# EAGLE design waldo-badge-2015-r1 (EAGLE 5.12)
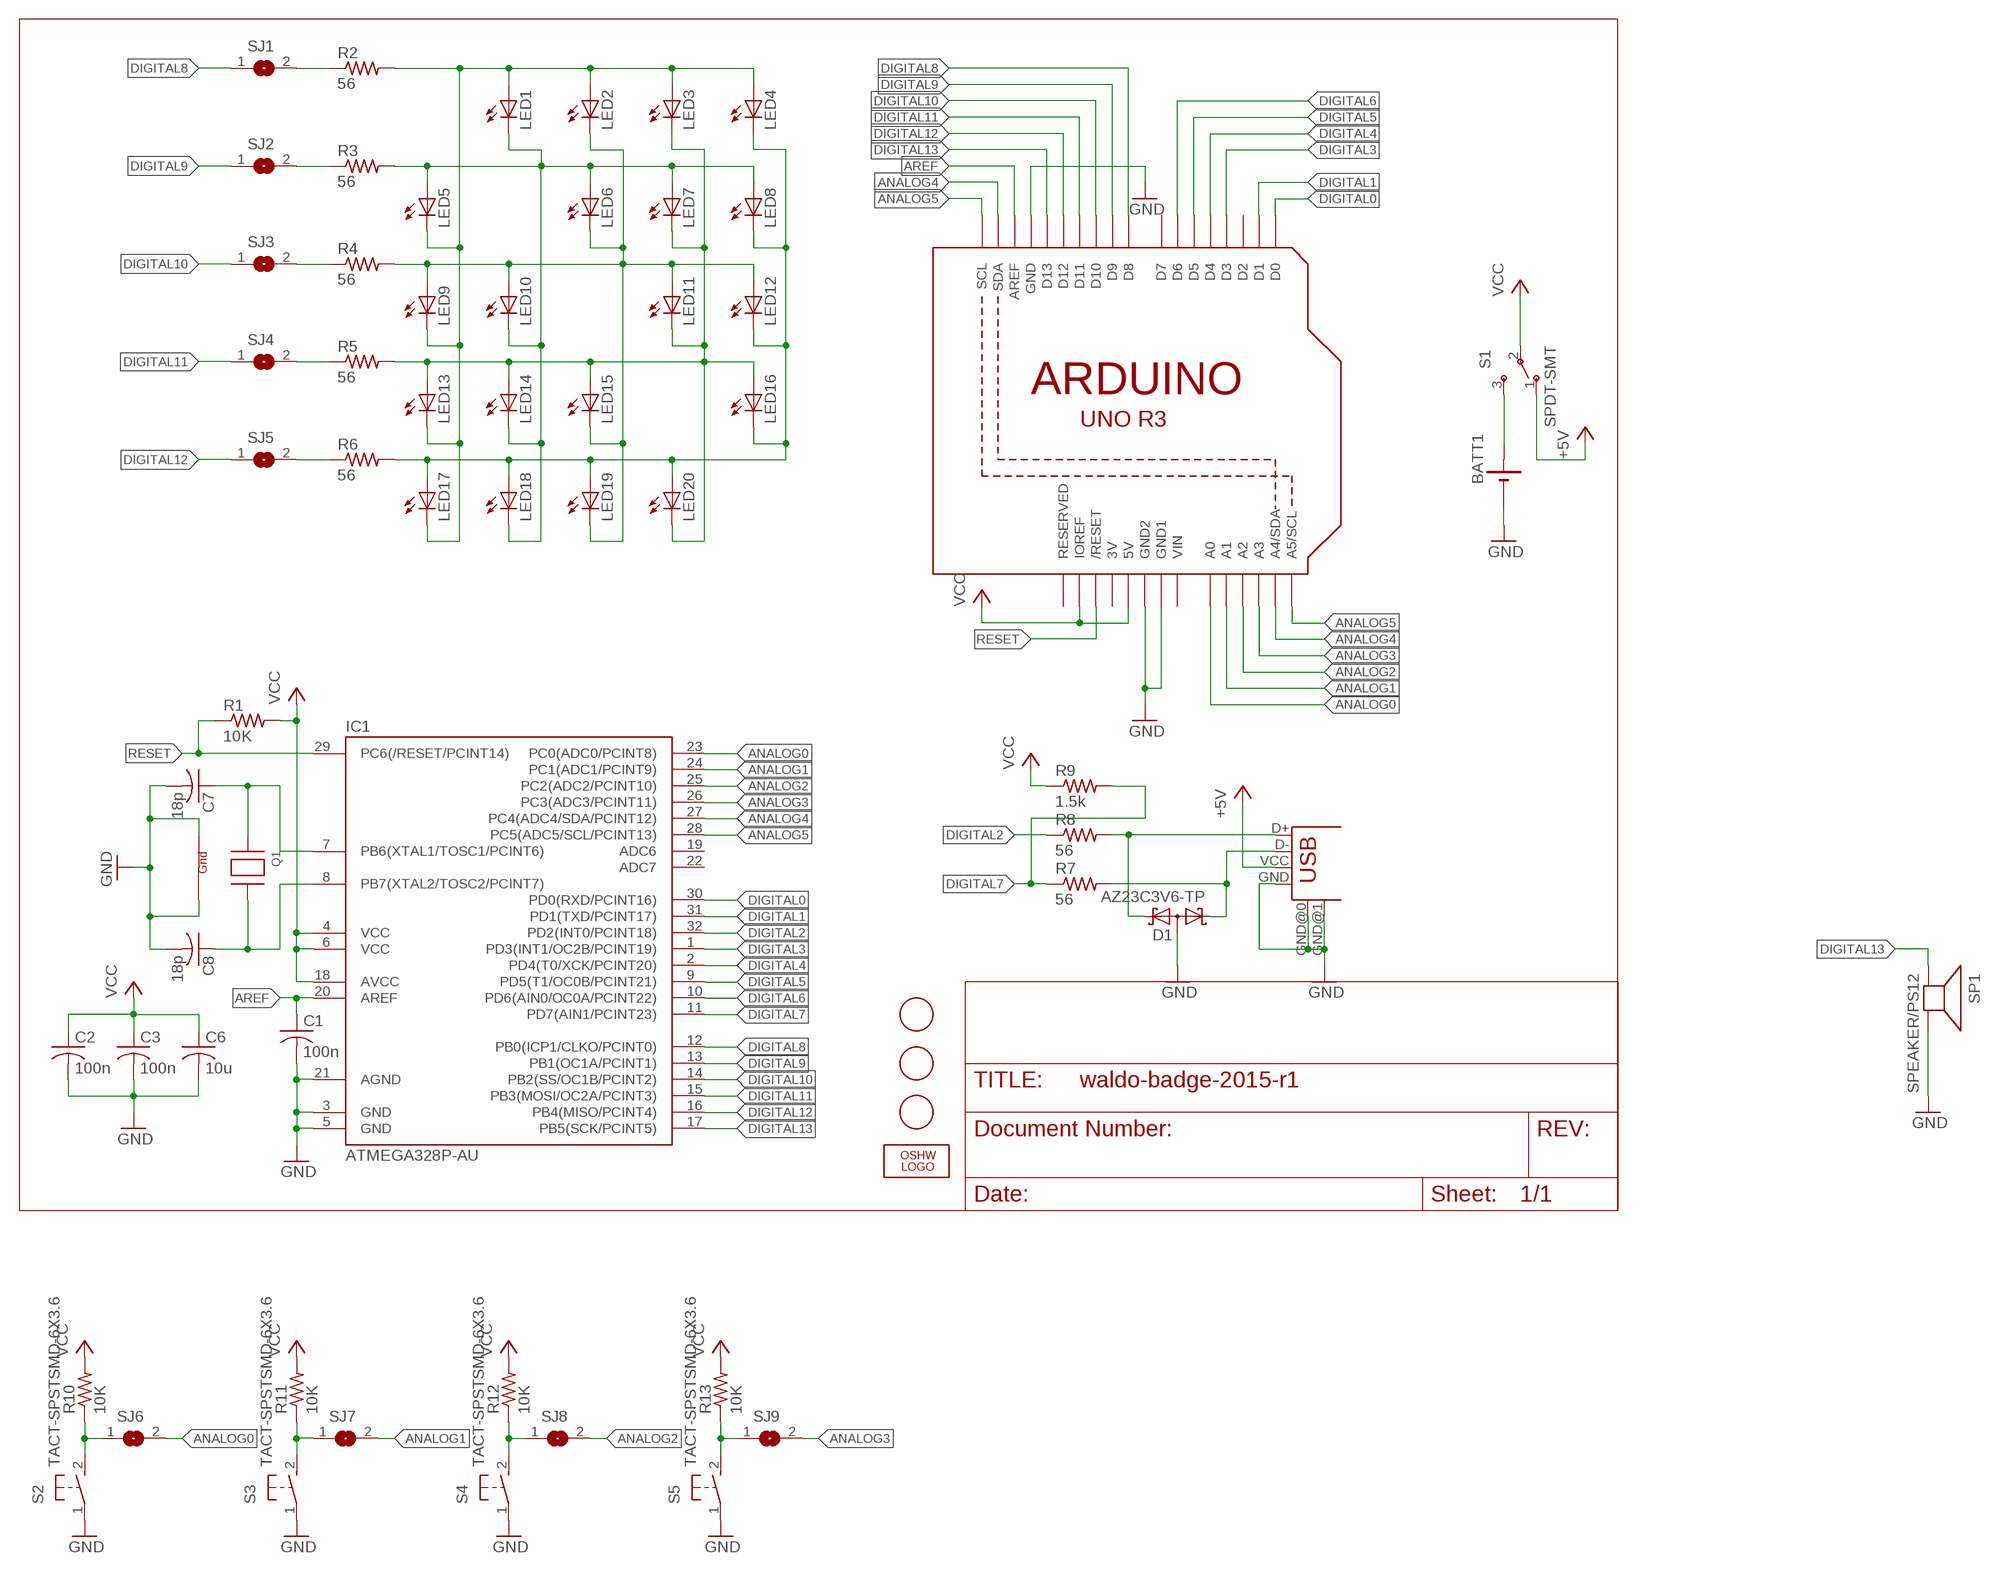
[diagram p0: schematic, sheet 1]

## Parts
BATT1  2032SMD  [2032SMD]
C1  100n  C-USC0603  [C0603]
C2  100n  C-USC0603  [C0603]
C3  100n  C-USC0603  [C0603]
C6  10u  C-USC0805  [C0805]
C7  18p  C-USC0603  [C0603]
C8  18p  C-USC0603  [C0603]
D1  AZ23C3V6-TP  BAS40-06  [SOT23]
IC1  ATMEGA328P-AU  MEGA48/88/168-AU  [TQFP32-08]
LED1  LEDCHIP-LED0603  [CHIP-LED0603]
LED2  LEDCHIP-LED0603  [CHIP-LED0603]
LED3  LEDCHIP-LED0603  [CHIP-LED0603]
LED4  LEDCHIP-LED0603  [CHIP-LED0603]
LED5  LEDCHIP-LED0603  [CHIP-LED0603]
LED6  LEDCHIP-LED0603  [CHIP-LED0603]
LED7  LEDCHIP-LED0603  [CHIP-LED0603]
LED8  LEDCHIP-LED0603  [CHIP-LED0603]
LED9  LEDCHIP-LED0603  [CHIP-LED0603]
LED10  LEDCHIP-LED0603  [CHIP-LED0603]
LED11  LEDCHIP-LED0603  [CHIP-LED0603]
LED12  LEDCHIP-LED0603  [CHIP-LED0603]
LED13  LEDCHIP-LED0603  [CHIP-LED0603]
LED14  LEDCHIP-LED0603  [CHIP-LED0603]
LED15  LEDCHIP-LED0603  [CHIP-LED0603]
LED16  LEDCHIP-LED0603  [CHIP-LED0603]
LED17  LEDCHIP-LED0603  [CHIP-LED0603]
LED18  LEDCHIP-LED0603  [CHIP-LED0603]
LED19  LEDCHIP-LED0603  [CHIP-LED0603]
LED20  LEDCHIP-LED0603  [CHIP-LED0603]
LOGO1  OSHW_LOGO_FILLX0150-NT  [OSHW_FILLX150_NOTEXT]
Q1  XTAL-4-3225  [NX3225]
R1  10K  R-US_R0603  [R0603]
R2  56  R-US_R0603  [R0603]
R3  56  R-US_R0603  [R0603]
R4  56  R-US_R0603  [R0603]
R5  56  R-US_R0603  [R0603]
R6  56  R-US_R0603  [R0603]
R7  56  R-US_R0603  [R0603]
R8  56  R-US_R0603  [R0603]
R9  1.5k  R-US_R0603  [R0603]
R10  10K  R-US_R0603  [R0603]
R11  10K  R-US_R0603  [R0603]
R12  10K  R-US_R0603  [R0603]
R13  10K  R-US_R0603  [R0603]
S1  SPDT-SMT  [SPDT-SMT]
S2  TACT-SPSTSMD-6X3.6  [6X3.6-SPST]
S3  TACT-SPSTSMD-6X3.6  [6X3.6-SPST]
S4  TACT-SPSTSMD-6X3.6  [6X3.6-SPST]
S5  TACT-SPSTSMD-6X3.6  [6X3.6-SPST]
SJ1  SJ  [SJ]
SJ2  SJ  [SJ]
SJ3  SJ  [SJ]
SJ4  SJ  [SJ]
SJ5  SJ  [SJ]
SJ6  SJ  [SJ]
SJ7  SJ  [SJ]
SJ8  SJ  [SJ]
SJ9  SJ  [SJ]
SP1  SPEAKER/PS12  [PS12]
U1  ARDUINOR3-NOISP  [ARDUINOR3-NOISP]
U$3  FIDUCIAL  [FIDUCIAL_1MM]
U$5  FIDUCIAL  [FIDUCIAL_1MM]
U$6  FIDUCIAL  [FIDUCIAL_1MM]
USB1  USB-U  [USB-MICROB-ALI]

## Nets
+5V: S1.1(O) USB1.VCC(VBUS)
ANALOG0: IC1.23(PC0(ADC0/PCINT8)) SJ6.2 U1.A0
ANALOG1: IC1.24(PC1(ADC1/PCINT9)) SJ7.2 U1.A1
ANALOG2: IC1.25(PC2(ADC2/PCINT10)) SJ8.2 U1.A2
ANALOG3: IC1.26(PC3(ADC3/PCINT11)) SJ9.2 U1.A3
ANALOG4: IC1.27(PC4(ADC4/SDA/PCINT12)) U1.A4(A4/SDA) U1.SDA
ANALOG5: IC1.28(PC5(ADC5/SCL/PCINT13)) U1.A5(A5/SCL) U1.SCL
AREF: C1.1 IC1.20(AREF) U1.AREF
CHARLIEPLEX1: LED1.A LED2.A LED3.A LED4.A LED5.C LED9.C LED13.C LED17.C R2.2
CHARLIEPLEX2: LED1.C LED5.A LED6.A LED7.A LED8.A LED10.C LED14.C LED18.C R3.2
CHARLIEPLEX3: LED2.C LED6.C LED9.A LED10.A LED11.A LED12.A LED15.C LED19.C R4.2
CHARLIEPLEX4: LED3.C LED7.C LED11.C LED13.A LED14.A LED15.A LED16.A LED20.C R5.2
CHARLIEPLEX5: LED4.C LED8.C LED12.C LED16.C LED17.A LED18.A LED19.A LED20.A R6.2
DIGITAL0: IC1.30(PD0(RXD/PCINT16)) U1.D0
DIGITAL1: IC1.31(PD1(TXD/PCINT17)) U1.D1
DIGITAL2: IC1.32(PD2(INT0/PCINT18)) R8.1
DIGITAL3: IC1.1(PD3(INT1/OC2B/PCINT19)) U1.D3
DIGITAL4: IC1.2(PD4(T0/XCK/PCINT20)) U1.D4
DIGITAL5: IC1.9(PD5(T1/OC0B/PCINT21)) U1.D5
DIGITAL6: IC1.10(PD6(AIN0/OC0A/PCINT22)) U1.D6
DIGITAL7: IC1.11(PD7(AIN1/PCINT23)) R7.1 R9.2
DIGITAL8: IC1.12(PB0(ICP1/CLKO/PCINT0)) SJ1.1 U1.D8
DIGITAL9: IC1.13(PB1(OC1A/PCINT1)) SJ2.1 U1.D9
DIGITAL10: IC1.14(PB2(SS/OC1B/PCINT2)) SJ3.1 U1.D10
DIGITAL11: IC1.15(PB3(MOSI/OC2A/PCINT3)) SJ4.1 U1.D11
DIGITAL12: IC1.16(PB4(MISO/PCINT4)) SJ5.1 U1.D12
DIGITAL13: IC1.17(PB5(SCK/PCINT5)) SP1.P$1(+) U1.D13
GND: BATT1.- C1.2 C2.2 C3.2 C6.2 C7.2 C8.2 D1.3(AA) IC1.3(GND) IC1.5(GND) IC1.21(AGND) Q1.2(G1) Q1.4(G2) S2.1(P) S3.1(P) S4.1(P) S5.1(P) SP1.P$2(-) U1.GND U1.GND1 U1.GND2 USB1.GND USB1.GND@0(GND) USB1.GND@1(GND)
N$1: R2.1 SJ1.2
N$3: R3.1 SJ2.2
N$5: R4.1 SJ3.2
N$6: BATT1.+ S1.3(S)
N$7: R5.1 SJ4.2
N$8: D1.2(K2) R8.2 USB1.D+
N$9: R6.1 SJ5.2
N$10: C7.1 IC1.7(PB6(XTAL1/TOSC1/PCINT6)) Q1.1(X1)
N$11: D1.1(K1) R7.2 USB1.D-
N$16: R10.1 S2.2(S) SJ6.1
N$17: R11.1 S3.2(S) SJ7.1
N$18: C8.1 IC1.8(PB7(XTAL2/TOSC2/PCINT7)) Q1.3(X2)
N$19: R12.1 S4.2(S) SJ8.1
N$20: R13.1 S5.2(S) SJ9.1
RESET: IC1.29(PC6(/RESET/PCINT14)) R1.1 U1.RESET(/RESET)
VCC: C2.1 C3.1 C6.1 IC1.4(VCC) IC1.6(VCC) IC1.18(AVCC) R1.2 R9.1 R10.2 R11.2 R12.2 R13.2 S1.2(P) U1.5V U1.IOREF
Unconnected: IC1.19(ADC6) IC1.22(ADC7) U1.D2 U1.D7 U1.RESERVED

## Power pins joined to a net without a drawn wire
3V: U1.3V
VIN: U1.VIN

## Library data of the parts
BATT1 = rbg-4ucon-battery:2032SMD
C1-C3 C6-C8 = rcl:C-US: CAPACITOR, American symbol
D1 = diode:BAS40-06: Silicon Schottky Diodes General-purpose diode for high-speed switching
IC1 = avr-4:MEGA48/88/168
LED1-LED20 = led:LED: LED OSRAM: - CHIPLED LG R971, LG N971, LY N971, LG Q971, LY Q971, LO R971, LY R971 LH N974, LH R974 LS Q976, LO Q976, LY Q976 LO Q996 - Hyper CHIPLED LW Q18S LB Q993, LB Q99A, LB R99A - SideLED LS A670, LO A670, LY A670, LG A670, LP A670 LB A673, LV A673, LT A673, LW A673 LH A674 LY A675 LS A676, LA A676, LO A676, LY A676, LW A676 LS A679, LY A679, LG A679 - Hyper Micro SIDELED® LS Y876, LA Y876, LO Y876, LY Y876 LT Y87S - SmartLED LW L88C, LW L88S LB L89C, LB L89S, LG L890 LS L89K, LO L89K, LY L89K LS L896, LA L896, LO L896, LY L896 - TOPLED LS T670, LO T670, LY T670, LG T670, LP T670 LSG T670, LSP T670, LSY T670, LOP T670, LYG T670 LG T671, LOG T671, LSG T671 LB T673, LV T673, LT T673, LW T673 LH T674 LS T676, LA T676, LO T676, LY T676, LB T676, LH T676, LSB T676, LW T676 LB T67C, LV T67C, LT T67C, LS T67K, LO T67K, LY T67K, LW E67C LS E67B, LA E67B, LO E67B, LY E67B, LB E67C, LV E67C, LT E67C LW T67C LS T679, LY T679, LG T679 LS T770, LO T770, LY T770, LG T770, LP T770 LB T773, LV T773, LT T773, LW T773 LH T774 LS E675, LA E675, LY E675, LS T675 LS T776, LA T776, LO T776, LY T776, LB T776 LHGB T686 LT T68C, LB T68C - Hyper Mini TOPLED® LB M676 - Mini TOPLED Santana® LG M470 LS M47K, LO M47K, LY M47K Source: http://www.osram.convergy.de LUXEON: - LUMILED® LXK2-PW12-R00, LXK2-PW12-S00, LXK2-PW14-U00, LXK2-PW14-V00 LXK2-PM12-R00, LXK2-PM12-S00, LXK2-PM14-U00 LXK2-PE12-Q00, LXK2-PE12-R00, LXK2-PE12-S00, LXK2-PE14-T00, LXK2-PE14-U00 LXK2-PB12-K00, LXK2-PB12-L00, LXK2-PB12-M00, LXK2-PB14-N00, LXK2-PB14-P00, LXK2-PB14-Q00 LXK2-PR12-L00, LXK2-PR12-M00, LXK2-PR14-Q00, LXK2-PR14-R00 LXK2-PD12-Q00, LXK2-PD12-R00, LXK2-PD12-S00 LXK2-PH12-R00, LXK2-PH12-S00 LXK2-PL12-P00, LXK2-PL12-Q00, LXK2-PL12-R00 Source: www.luxeon.com KINGBRIGHT: KA-3528ASYC Source: www.kingbright.com
LOGO1 = ohw-logo:OSHW_LOGO_FILL
Q1 = adafruit:XTAL-4: Classic 4-pin 3.2 x 2.5mm crystal
R1-R13 = rcl:R-US_: RESISTOR, American symbol
S1 = smt-spdt-aliexpress:SPDT-SMT
S2-S5 = rbg-generic-tact-switch:TACT-SPST
SJ1-SJ9 = jumper:SJ: SMD solder JUMPER
SP1 = adafruit:SPEAKER: SPEAKER Source: Buerklin Added PS12 (for part # PS1240 piezo) http://www.ladyada.net/library/pcb/eaglelibrary.html
U1 = rbg-arduino-shield:ARDUINOR3-NOISP
U$3 U$5 U$6 = adafruit:FIDUCIAL: For use by pick and place machines to calibrate the vision/machine, 1mm By microbuilder.eu
USB1 = con-usb-2:USB: USB Connectors

## Board
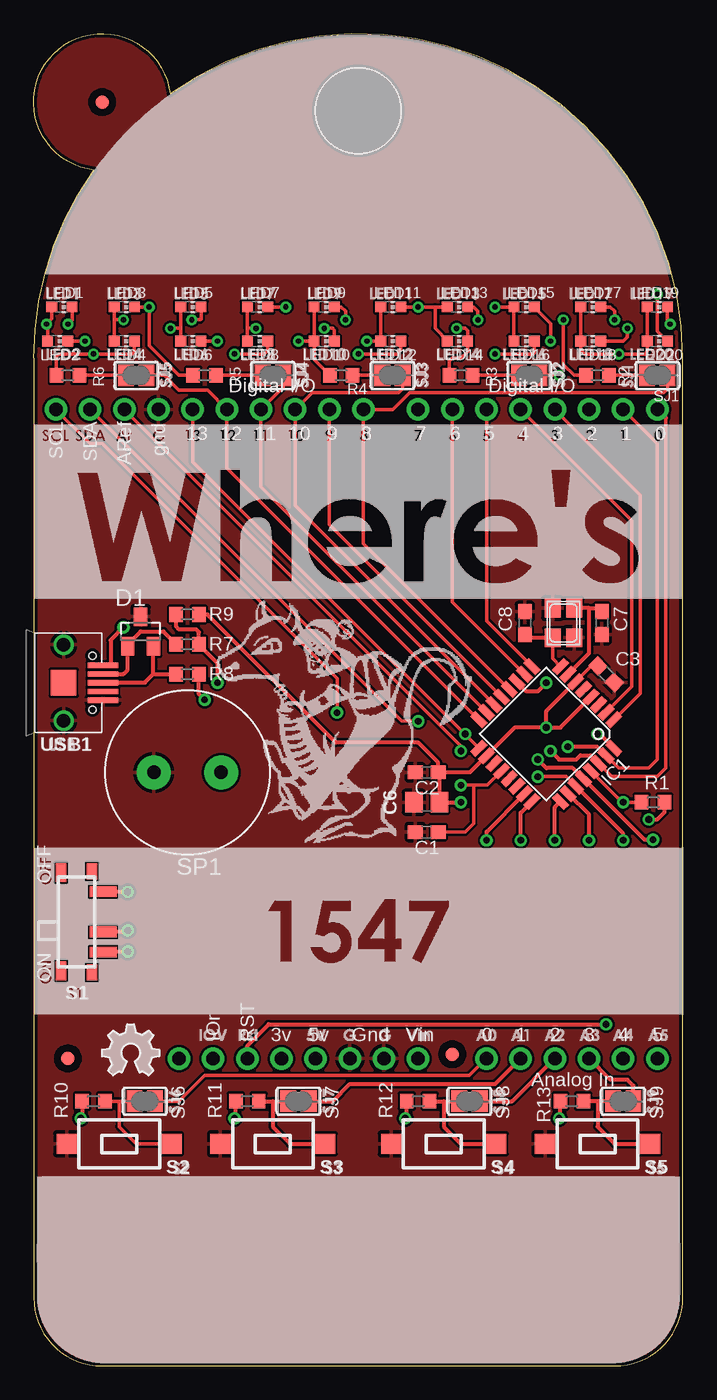
[diagram p1: board, top side]
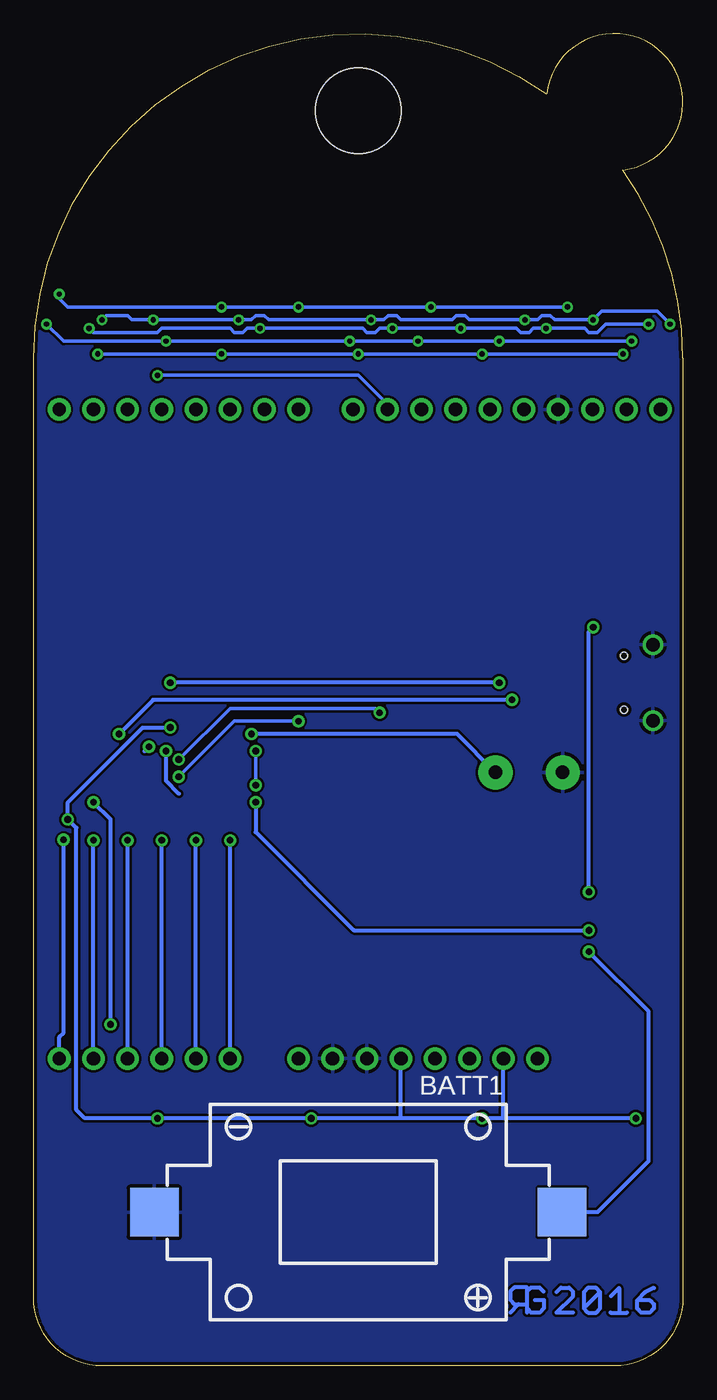
[diagram p2: board, bottom side, seen from below]

Size 48.27 x 99.07 mm. Coordinates in mm from the lower left corner, seen from the top.
Outline: 4.48,88.92 arc35 0.01,74.93 0.01,5.08 arc90 5.09,0 43.19,0 arc90 48.27,5.08 48.27,74.93 arc125 10.15,94.59
Outline: 4.48,88.92 arc-256 10.14,94.59
Copper layers (1*16): Top 0.035mm / dielectric 1.5mm / Bottom 0.035mm
Design rules "default *": minimum track width 8mil, minimum drill 0.4mm, track to track 7mil, track to pad 7mil, pad to pad 7mil, via to via 7mil, smd to smd 7mil, copper to edge 10mil, drill to drill 8mil, minimum pad ring 10mil, minimum via ring 8mil, stop-mask expansion 4mil, vias tented up to drill 20mil, thermal gap 10mil
Holes 6.35 mm at 24.14,93.34

### Footprints (pad centres in the part's own frame; a part is rotated, then mirrored left to right if it is on the bottom)
2032SMD = smd 3.6 x 3.6: + -15.15,0; - 15.15,0
C0603 = smd 1.1 x 1: 1 -0.85,0; 2 0.85,0
C0805 = smd 1.3 x 1.5: 1 -0.95,0; 2 0.95,0
SOT23 = smd 1 x 1.4: 1 -0.95,-1.1; 2 0.95,-1.1; 3 0,1.1
TQFP32-08 = smd 1.27 x 0.559: 1 -4.293,2.8; 2 -4.293,2; 3 -4.293,1.2; 4 -4.293,0.4; 5 -4.293,-0.4; 6 -4.293,-1.2; 7 -4.293,-2; 8 -4.293,-2.8; 17 4.293,-2.8; 18 4.293,-2; 19 4.293,-1.2; 20 4.293,-0.4; 21 4.293,0.4; 22 4.293,1.2; 23 4.293,2; 24 4.293,2.8 | smd 0.559 x 1.27: 9 -2.8,-4.293; 10 -2,-4.293; 11 -1.2,-4.293; 12 -0.4,-4.293; 13 0.4,-4.293; 14 1.2,-4.293; 15 2,-4.293; 16 2.8,-4.293; 25 2.8,4.293; 26 2,4.293; 27 1.2,4.293; 28 0.4,4.293; 29 -0.4,4.293; 30 -1.2,4.293; 31 -2,4.293; 32 -2.8,4.293
CHIP-LED0603 = smd 0.8 x 0.8: A 0,-0.75; C 0,0.75
NX3225 = smd 1.4 x 1.2: 1 -1.1,0.8; 2 1.1,0.8; 3 1.1,-0.8; 4 -1.1,-0.8
R0603 = smd 1 x 1.1: 1 -0.85,0; 2 0.85,0
SPDT-SMT = smd 2 x 0.8: 1 -2,-2.25; 2 -2,0.75; 3 -2,2.25 | smd 0.8 x 1.2: A -1.15,3.75; D -1.15,-3.75 | smd 0.8 x 1.4: B 1.15,3.65; C 1.15,-3.65
6X3.6-SPST = smd 1.5 x 1.5: 1 -3.9,0; 2 3.9,0
SJ = smd 1.168 x 1.6: 1 -0.762,0; 2 0.762,0
PS12 = drill 1 pad 2.54 round: P$1 -2.5,0; P$2 2.5,0
ARDUINOR3-NOISP = drill 1 pad 1.676 round: 3V 17.78,2.54; 5V 20.32,2.54; A0 33.02,2.54; A1 35.56,2.54; A2 38.1,2.54; A3 40.64,2.54; A4 43.18,2.54; A5 45.72,2.54; AREF 6.096,50.8; D0 45.72,50.8; D1 43.18,50.8; D2 40.64,50.8; D3 38.1,50.8; D4 35.56,50.8; D5 33.02,50.8; D6 30.48,50.8; D7 27.94,50.8; D8 23.876,50.8; D9 21.336,50.8; D10 18.796,50.8; D11 16.256,50.8; D12 13.716,50.8; D13 11.176,50.8; GND 8.636,50.8; GND1 25.4,2.54; GND2 22.86,2.54; IOREF 12.7,2.54; RESERVED 10.16,2.54; RESET 15.24,2.54; SCL 1.016,50.8; SDA 3.556,50.8; VIN 27.94,2.54
FIDUCIAL_1MM = smd 1 x 1: 1 0,0
USB-MICROB-ALI = smd 0.4 x 2.25: D+ 0,2.925; D- -0.65,2.925; GND 1.3,2.925; ID 0.65,2.925; VCC -1.3,2.925 | drill 1 round: GND@0 -2.825,0; GND@1 2.825,0 | smd 1.9 x 1.9: GND@2 0,0 | hole 0.55: -2,2.15; 2,2.15

### Placement (x,y rotation side)
BATT1  24.14,11.43 180 bottom
C1  29.22,39.69 180 top
C2  29.22,44.13 180 top
C3  42.55,51.44 315 top
C6  29.22,41.91 180 top
C7  42.24,55.24 270 top
C8  36.52,55.24 90 top
D1  7.95,54.61 0 top
IC1  38.11,46.99 225 top
LED1  2.1,78.74 270 top
LED2  1.79,76.2 270 top
LED3  6.74,78.74 270 top
LED4  6.74,76.2 270 top
LED5  11.69,78.74 270 top
LED6  11.69,76.2 270 top
LED7  16.65,78.74 270 top
LED8  16.65,76.2 270 top
LED9  21.6,78.74 270 top
LED10  21.6,76.2 270 top
LED11  26.55,78.74 270 top
LED12  26.55,76.2 270 top
LED13  31.51,78.74 270 top
LED14  31.51,76.2 270 top
LED15  36.46,78.74 270 top
LED16  36.46,76.2 270 top
LED17  41.41,78.74 270 top
LED18  41.41,76.2 270 top
LED19  46.36,78.74 270 top
LED20  46.36,76.2 270 top
LOGO1  5.09,21.59 0 top
Q1  39.38,55.24 270 top
R1  46.05,41.91 0 top
R2  41.92,73.66 180 top
R3  31.76,73.66 180 top
R4  22.87,73.66 180 top
R5  12.71,73.66 180 top
R6  2.55,73.66 180 top
R7  11.44,53.66 180 top
R8  11.44,51.44 180 top
R9  11.44,55.88 180 top
R10  4.45,19.68 180 top
R11  15.88,19.68 180 top
R12  28.58,19.68 180 top
R13  40.01,19.68 180 top
S1  3.18,33.02 180 top
S2  6.36,16.51 0 top
S3  17.79,16.51 0 top
S4  30.49,16.51 0 top
S5  41.92,16.51 0 top
SJ1  46.36,73.66 180 top
SJ2  36.84,73.66 180 top
SJ3  26.68,73.66 180 top
SJ4  17.79,73.66 180 top
SJ5  7.63,73.66 180 top
SJ6  8.26,19.68 0 top
SJ7  19.69,19.68 0 top
SJ8  32.39,19.68 0 top
SJ9  43.82,19.68 0 top
SP1  11.44,44.13 180 top
U1  0.64,20.32 0 top
U$1  [TOQUE_TOP]  24.14,93.34 0 top
U$2  [SILKSCREEN]  0.01,-1.27 0 top
U$3  5.09,93.98 0 top
U$5  2.55,22.86 0 top
U$6  31.12,23.18 0 top
U$7  [RGLOGO_SMALL_2016]  11.44,3.81 0 bottom
USB1  2.23,50.8 270 top

### Tracks (layer width: path | path; a pad name or v marks a point on that pad's centre or on a via)
+5V  (via drill 0.5)
  Top 0.305: v6.99,35.24 6.97,35.27 S1.1 | USB1.VCC 5.72,52.1 5.72,53.98 v6.68,54.93
  Bottom 0.305: v6.99,35.24 6.99,54.61 v6.68,54.93
ANALOG0  (via drill 0.5)
  Top 0.254: SJ6.2 10.8,19.68 12.71,21.59 32.39,21.59 U1.A0
  Top 0.305: v33.66,39.08 33.66,39.72 IC1.23
  Bottom 0.305: U1.A0 v33.66,39.08
ANALOG1  (via drill 0.5)
  Top 0.305: v36.2,39.08 36.2,41.12 IC1.24 | U1.A1 34.3,20.95 23.5,20.95 22.23,19.68 SJ7.2
  Bottom 0.305: U1.A1 v36.2,39.08
ANALOG2  (via drill 0.5)
  Top 0.305: v38.74,39.08 38.74,41.55 IC1.25 | U1.A2 35.57,19.68 SJ8.2
  Bottom 0.305: U1.A2 v38.74,39.08
ANALOG3  (via drill 0.5)
  Top 0.305: v41.28,39.08 41.28,40.99 IC1.26 | U1.A3 42.87,21.27 44.14,21.27 44.59,20.83 SJ9.2
  Bottom 0.305: U1.A3 v41.28,39.08
ANALOG4  (via drill 0.5)
  Top 0.254: IC1.27 39.59,43.81 v37.47,43.81 | U1.SDA 27.38,47.94 v28.58,47.94
  Top 0.305: v43.82,39.08 43.82,39.58 IC1.27
  Bottom 0.254: v37.47,43.81 33.35,47.94 v28.58,47.94
  Bottom 0.305: U1.A4 v43.82,39.08
ANALOG5  (via drill 0.5)
  Top 0.254: U1.SCL 4.2,68.58 5.09,68.58 22.55,51.12 v22.55,48.58
  Top 0.305: v37.47,45.09 38.11,44.45 40.08,44.45 IC1.28 45.41,39.12 v46.05,39.12
  Bottom 0.254: v37.47,45.09 33.66,48.9 22.87,48.9 v22.55,48.58
  Bottom 0.305: U1.A5 46.36,24.45 46.05,24.77 v46.05,39.12
AREF  (via drill 0.5)
  Top 0.254: IC1.20 33.73,43.18 32.71,43.18 | 32.71,43.18 v31.76,43.18 | U1.AREF 31.76,46.1 v31.76,45.72 | C1.1 32.08,39.69 32.71,40.32 32.71,43.18
  Bottom 0.254: v31.76,43.18 v31.76,45.72
CHARLIEPLEX1  (via drill 0.4)
  Top 0.254: LED2.A 1.04,77.55 v0.96,77.47 1.35,77.86 LED1.A | R2.2 40.17,73.66 39.38,74.45 v39.38,77.79 | v43.19,77.79 43.19,78.42 42.87,78.74 LED17.C | LED9.C 22.87,78.74 23.19,78.42 v23.19,77.79 | LED13.C 32.71,78.74 33.03,78.42 v33.03,77.79 | LED4.A LED3.A 5.99,77.84 6.04,77.79 v6.68,77.79 | LED5.C 12.44,77.84 12.39,77.79 v11.76,77.79
  Bottom 0.254: v43.19,77.79 42.87,78.11 41.28,78.11 40.97,77.79 v39.38,77.79 v33.03,77.79 32.08,77.79 31.76,78.11 31.12,78.11 30.81,77.79 v23.19,77.79 22.23,77.79 21.92,78.11 21.28,78.11 20.96,77.79 17.15,77.79 16.84,78.11 16.2,78.11 15.88,77.79 v11.76,77.79 10.8,77.79 10.49,78.11 9.85,78.11 9.53,77.79 v6.68,77.79 6.04,78.42 1.91,78.42 v0.96,77.47
CHARLIEPLEX2  (via drill 0.4)
  Top 0.254: R3.2 30.91,74.72 31.12,74.93 31.76,74.93 32.26,75.43 LED14.C 32.26,76.97 32.08,77.15 v31.44,77.15 | 15.9,77.14 LED7.A | 10.94,77.15 LED6.A 10.94,77.01 | 10.94,77.15 LED5.A | 2.56,77.48 2.54,77.48 v2.55,77.47 2.85,77.78 LED1.C | 15.9,77.14 LED8.A | v10.17,77.15 10.94,77.15 | v16.52,77.15 15.91,77.15 15.9,77.14 | LED10.C 22.35,77.04 22.23,77.15 v21.6,77.15 | LED18.C 43.82,76.2 44.14,76.52 v44.14,77.15
  Bottom 0.254: v44.14,77.15 43.82,76.83 39.06,76.83 38.74,77.15 33.66,77.15 33.35,76.83 32.71,76.83 32.39,77.15 v31.44,77.15 23.82,77.15 23.5,76.83 22.87,76.83 22.55,77.15 v21.6,77.15 v16.52,77.15 12.39,77.15 12.07,76.83 11.44,76.83 11.12,77.15 v10.17,77.15 7.31,77.15 6.99,76.83 6.36,76.83 5.72,77.47 v2.55,77.47
CHARLIEPLEX3  (via drill 0.4)
  Top 0.254: LED10.A 20.85,74.83 R4.2 | LED10.A LED9.A | LED11.A LED12.A v24.77,76.2 | v19.69,76.2 LED10.A | LED2.C v3.82,76.2 | v13.66,76.2 LED6.C | LED15.C 38.43,77.52 v38.43,76.2 | LED19.C 47.11,77.67 v47.32,77.47
  Bottom 0.254: v3.82,76.2 v13.66,76.2 v19.69,76.2 v24.77,76.2 v38.43,76.2 46.05,76.2 v47.32,77.47
CHARLIEPLEX4  (via drill 0.4)
  Top 0.254: LED3.C v8.58,78.74 8.58,75.88 10.8,73.66 R5.2 | v46.36,79.69 46.36,76.95 LED20.C | v18.74,78.74 LED7.C | LED11.C v28.58,78.74 29.85,78.74 | 29.85,78.74 LED13.A | v34.3,78.74 LED15.A LED16.A | LED14.A 30.76,76.25 29.85,77.15 29.85,78.74
  Bottom 0.254: v8.58,78.74 v18.74,78.74 v28.58,78.74 v34.3,78.74 45.73,78.74 46.36,79.38 v46.36,79.69
CHARLIEPLEX5  (via drill 0.4)
  Top 0.254: LED19.A LED20.A 45.61,75.45 45.41,75.25 v43.51,75.25 40.97,75.25 40.66,75.55 LED18.A LED17.A | LED4.C 7.49,75.43 7.31,75.25 v4.45,75.25 1.91,75.25 1.7,75.03 R6.2 | LED8.C 17.4,75.49 17.15,75.25 v14.93,75.25 | v24.14,75.25 27,75.25 27.3,75.55 LED12.C | LED16.C 37.21,75.3 37.16,75.25 v34.3,75.25
  Bottom 0.254: v4.45,75.25 v14.93,75.25 v24.14,75.25 v34.3,75.25 v43.51,75.25
DIGITAL0  (via drill 0.5)
  Top 0.254: IC1.30 42.98,43.81 46.36,43.81 47,44.45 47,70.48
  Top 0.305: 47,70.48 U1.D0 | v38.43,45.72 39.06,45.09 40.33,45.09 40.65,45.4 41.39,45.4 IC1.30
  Bottom 0.305: 37.47,42.55 38.43,43.5 v38.43,45.72
DIGITAL1  (via drill 0.5)
  Top 0.254: IC1.31 43.48,44.45 45.73,44.45 46.36,45.09 46.36,68.58 U1.D1
  Top 0.305: v39.7,46.04 41.89,46.04 IC1.31
  Bottom 0.305: v39.7,46.04 40.01,45.72
DIGITAL2  (via drill 0.5)
  Top 0.305: v41.92,46.99 42.07,46.99 IC1.32 | R8.1 12.29,49.95 v12.71,49.53
  Bottom 0.305: v12.71,49.53 39.38,49.53 v41.92,46.99
DIGITAL3
  Top 0.254: IC1.1 45.09,50.02 45.09,64.77 U1.D3
DIGITAL4
  Top 0.254: IC1.2 44.46,50.51 44.46,62.87 U1.D4
DIGITAL5
  Top 0.254: U1.D5 33.66,55.4 IC1.9
DIGITAL6
  Top 0.254: U1.D6 31.12,56.8 IC1.10
DIGITAL7  (via drill 0.5)
  Top 0.305: IC1.11 36.63,50.16 37.47,50.16 v38.11,50.8 | R9.2 10.59,54.98 10.8,54.77 12.07,54.77 12.29,54.55 R7.1 13.66,52.28 v13.66,50.8
  Bottom 0.305: v13.66,50.8 v38.11,50.8
DIGITAL8
  Top 0.254: IC1.12 24.52,61.15 U1.D8 26.68,71.12 27.95,72.39 46.84,72.39 47.13,72.68 SJ1.1
DIGITAL9  (via drill 0.4)
  Top 0.254: U1.D9 21.98,62.55 IC1.13 | v39.06,73.66 SJ2.1
  Bottom 0.254: U1.D9 21.98,71.5 24.14,73.66 v39.06,73.66
DIGITAL10
  Top 0.254: IC1.14 19.44,63.96 U1.D10 20.71,72.39 27.16,72.39 27.44,72.68 SJ3.1
DIGITAL11
  Top 0.254: IC1.15 16.9,65.37 U1.D11 18.55,72.77 SJ4.1
DIGITAL12
  Top 0.254: IC1.16 14.36,66.78 U1.D12 12.93,72.55 10.8,72.55 9.69,73.66 SJ5.1
DIGITAL13  (via drill 0.5)
  Top 0.254: U1.D13 11.82,67.21 32.04,46.99 v32.08,46.99 | 32.08,46.95 IC1.17
  Top 0.305: v32.08,46.99 32.08,46.95
  Bottom 0.305: v32.08,46.99 16.8,46.99 SP1.P$1
GND
  pour Top: -1.26,100.33 50.81,100.33 50.81,-1.27 -1.26,-1.27
  pour Bottom: -1.26,100.33 50.81,100.33 50.81,-1.27 -1.26,-1.27
N$1
  Top 0.254: R2.1 SJ1.2
N$2
  Top 0.203: 17.15,73.66 18.42,73.66
N$3
  Top 0.254: R3.1 SJ2.2
N$4
  Top 0.203: 6.99,73.66 8.26,73.66
N$5
  Top 0.254: R4.1 SJ3.2
N$6  (via drill 0.5)
  Top 0.305: v6.99,30.8 6.97,30.77 S1.3
  Bottom 0.305: BATT1.+ 6.36,11.43 2.55,15.24 2.55,26.35 v6.99,30.8
N$7
  Top 0.254: R5.1 SJ4.2
N$8
  Top 0.254: D1.2
  Top 0.305: 8.9,51.44 D1.2 | 8.9,51.44 R8.2 | USB1.D+ 8.26,50.8 8.9,51.44
N$9
  Top 0.254: R6.1 SJ5.2
N$10
  Top 0.305: 41.28,56.34 Q1.1 | 41.28,56.34 41.99,56.34 C7.1 | IC1.7 41.28,52.99 41.28,56.34
N$11
  Top 0.305: USB1.D- 6.69,51.45 6.99,51.75 D1.1 7,53.66 7.95,54.61 9.64,54.61 R7.2
N$13
  Top 0.203: 26.04,73.66 27.31,73.66
N$14
  Top 0.203: 36.2,73.66 37.47,73.66
N$15
  Top 0.203: 45.73,73.66 47,73.66
N$16
  Top 0.254: S2.2 7.63,16.51 6.36,17.78 6.36,19.68 | 6.36,19.68 R10.1 | SJ6.1 6.36,19.68
N$17
  Top 0.305: S3.2 19.06,16.51 17.79,17.78 17.79,19.68 | R11.1 17.79,19.68 | 17.79,19.68 SJ7.1
N$18
  Top 0.254: IC1.8 38.58,52.59 Q1.3
  Top 0.305: Q1.3 36.77,54.15 C8.1
N$19
  Top 0.305: S4.2 31.76,16.51 30.49,17.78 30.49,19.68 | R12.1 30.49,19.68 | 30.49,19.68 SJ8.1
N$20
  Top 0.305: S5.2 43.19,16.51 41.92,17.78 41.92,19.68 | 41.92,19.68 R13.1 | SJ9.1 41.92,19.68
N$21
  Top 0.203: 19.06,19.68 20.33,19.68
N$22
  Top 0.203: 31.76,19.68 33.03,19.68
N$23
  Top 0.203: 8.9,19.68 7.63,19.68
N$24
  Top 0.203: 44.46,19.68 43.19,19.68
RESET  (via drill 0.5)
  Top 0.254: IC1.29 43.76,41.91 v43.82,41.91 R1.1
  Top 0.305: v42.55,25.4 17.47,25.4 15.88,23.81 U1.RESET
  Bottom 0.305: v42.55,25.4 42.55,40.64 v43.82,41.91
VCC  (via drill 0.5)
  Top 0.254: IC1.6 41.46,52.04 C3.1
  Top 0.305: IC1.6 38.11,48.69 v38.11,47.47 | IC1.4 39.15,47.47 v38.11,47.47 | v38.11,47.47 35.76,47.47 IC1.18 32.42,44.13 C2.1 | R9.1 12.92,55.88 22.45,46.35 28.58,46.35 30.07,44.87 C2.1 | R13.2 39.16,18.52 v39.06,18.41 | v3.5,18.41 3.6,18.52 R10.2 | R11.2 15.03,18.52 v14.93,18.41 | R12.2 27.73,18.52 v27.63,18.41 | S1.2 6.88,32.27 v6.99,32.38 | v31.76,41.91 C6.1 30.17,44.03 C2.1 | R1.2 46.9,41.17 46.36,40.64 v45.73,40.64
  Bottom 0.305: 40.17,47.47 v38.11,47.47 | v3.5,18.41 13.34,18.41 | 13.34,18.41 v14.93,18.41 20.96,18.41 | 20.96,18.41 v27.63,18.41 v39.06,18.41 44.46,18.41 45.09,19.05 45.09,40.01 v45.73,40.64 45.73,41.91 40.17,47.47 | 13.34,18.41 U1.IOREF | 20.96,18.41 U1.5V | v6.99,32.38 24.46,32.38 31.76,39.69 v31.76,41.91 | 40.17,47.47

### Text on the board
tNames: OFF | ON
_bsilk: BATT1